# EAGLE design emonPi2C_V1.1 (EAGLE 7.3.0)
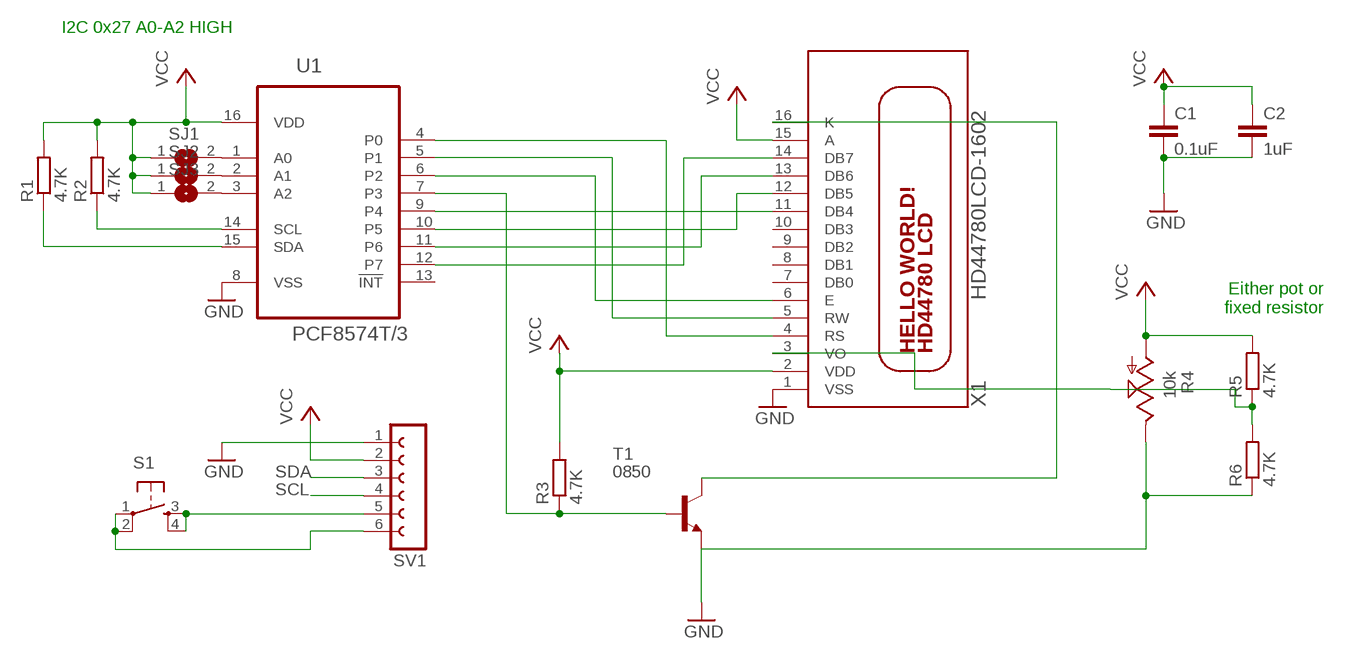
[diagram p0: schematic, sheet 1]

## Parts
C1  0.1uF  C-EUC0603  [C0603]
C2  1uF  C-EUC0603  [C0603]
R1  4.7K  R-EU_R0603  [R0603]
R2  4.7K  R-EU_R0603  [R0603]
R3  4.7K  R-EU_R0603  [R0603]
R4  10k  TRIM_US-B25P  [B25P]
R5  4.7K  R-EU_R0603  [R0603]
R6  4.7K  R-EU_R0603  [R0603]
S1  TAC_SWITCHPTH  [TACTILE-PTH]
SJ1  SJ  [SJ]
SJ2  SJ  [SJ]
SJ3  SJ  [SJ]
SV1  FE06-1  [FE06]
T1  0850  BCX70SMD  [SOT23]
U1  PCF8574T/3  [SOIC127P1032X265-16N]
X1  HD44780LCD-1602  [LCD1602]

## Nets
5V [Power]: C1.1 C2.1 R1.2 R2.2 R3.2 R4.A R5.2 SJ1.1 SJ2.1 SJ3.1 SV1.2 U1.16(VDD) X1.2(VDD) X1.15(A) ; supply symbol labelled VCC
CS: U1.6(P2) X1.6(E)
DB4: U1.9(P4) X1.11(DB4)
DB5: U1.10(P5) X1.12(DB5)
DB6: U1.11(P6) X1.13(DB6)
DB7: U1.12(P7) X1.14(DB7)
GND: C1.2 C2.2 R4.E R6.1 SV1.1 T1.2(E) U1.8(VSS) X1.1(VSS)
K: T1.3(C) X1.16(K)
N$3: SJ3.2 U1.3(A2)
N$4: SJ2.2 U1.2(A1)
N$5: S1.3 S1.4 SV1.5
N$6: S1.1 S1.2 SV1.6
N$7: SJ1.2 U1.1(A0)
N$10: R4.S R5.1 R6.2 X1.3(VO)
P3: R3.1 T1.1(B) U1.7(P3)
RS: U1.4(P0) X1.4(RS)
RW: U1.5(P1) X1.5(RW)
SCL: R2.1 SV1.4 U1.14(SCL)
SDA: R1.1 SV1.3 U1.15(SDA)
Unconnected: U1.13(!INT) X1.7(DB0) X1.8(DB1) X1.9(DB2) X1.10(DB3)

## Notes on the sheet
- I2C 0x27 A0-A2 HIGH
- Either pot or
  fixed resistor

## Library data of the parts
C1 C2 = resistor:C-EU: CAPACITOR, European symbol
R1-R3 R5 R6 = rcl:R-EU_: RESISTOR, European symbol
R4 = pot:TRIM_US-: POTENTIOMETER
S1 = SparkFun-Electromechanical:TAC_SWITCH: Momentary Switch Button commonly used for reset or general input. Spark Fun Electronics SKU : COM-00097 SMT- SWCH-08247
SJ1-SJ3 = jumper:SJ: SMD solder JUMPER
SV1 = con-lsta:FE06-1: FEMALE HEADER; OC_FARNELL: unknown; OC_NEWARK: unknown
T1 = transistor:BCX70SMD: NPN TRANSISTOR
U1 = PCF8574T:PCF8574T/3: I/O EXPANDER, 8BIT REMOTE, SO-16; MPN: PCF8574T/3; OC_FARNELL: 1506644; OC_NEWARK: Unknown; PACKAGE: SO-16; SUPPLIER: NXP
X1 = adafruit:HD44780LCD: HD44780 LCD Standard character type LCDs, available in sizes from 8x1 to 40x4!

## Net classes
0 default: width 0.254 mm, drill 0.5 mm, clearance 0.254 mm
1 Power: width 0.61 mm, drill 0.5 mm, clearance 0.406 mm

## Board
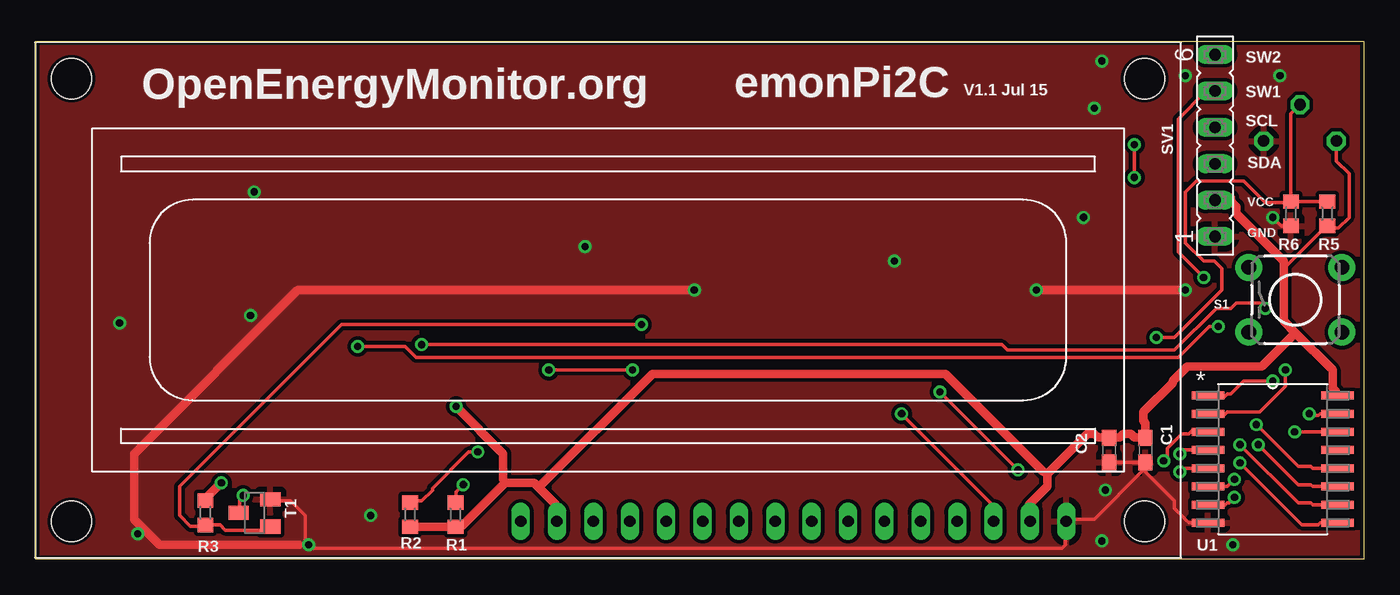
[diagram p1: board, top side]
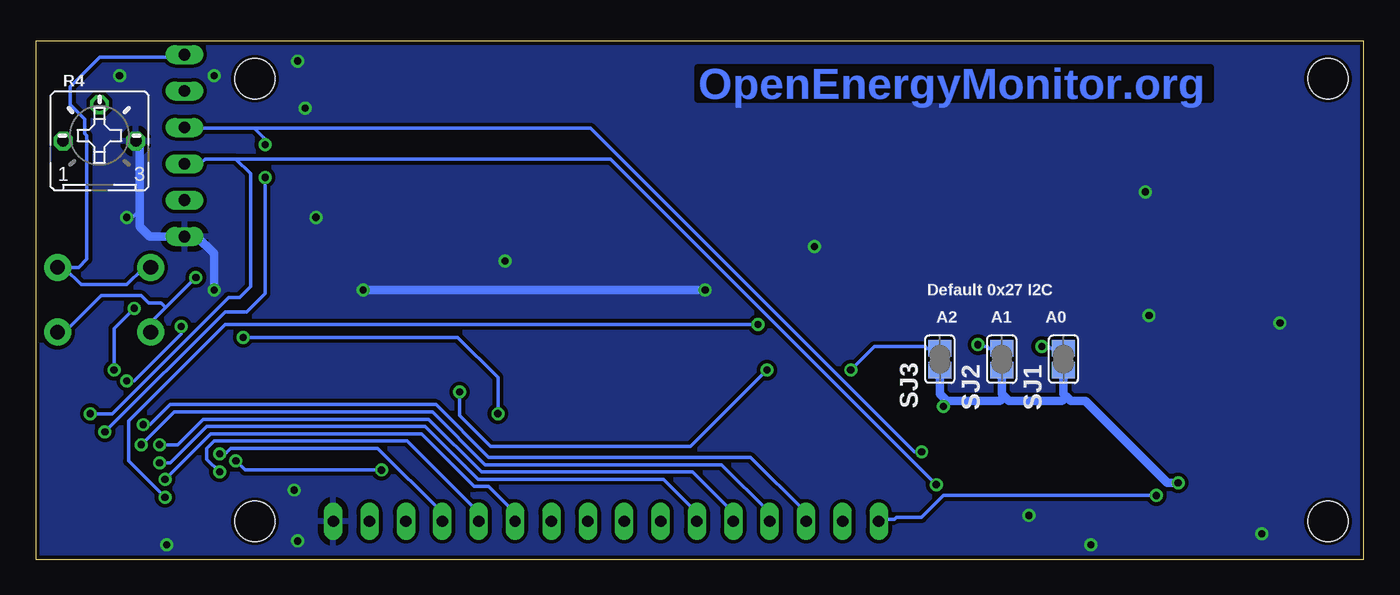
[diagram p2: board, bottom side, seen from below]

Size 92.71 x 36.2 mm. Coordinates in mm from the lower left corner, seen from the top.
Outline: 0,36.2 92.71,36.2 92.71,0 0,0 0,36.2
Copper layers (1*16): Top 0.035mm / dielectric 1.5mm / Bottom 0.035mm
Design rules "default *": minimum track width 8mil, minimum drill 0.5mm, track to track 8mil, track to pad 8mil, pad to pad 8mil, via to via 8mil, smd to smd 8mil, copper to edge 10mil, drill to drill 10mil, minimum pad ring 10mil, minimum via ring 8mil, stop-mask expansion 4mil, vias tented up to drill 0.5mm, thermal gap 16mil

### Footprints (pad centres in the part's own frame; a part is rotated, then mirrored left to right if it is on the bottom)
C0603 = smd 1.1 x 1: 1 -0.85,0; 2 0.85,0
R0603 = smd 1 x 1.1: 1 -0.85,0; 2 0.85,0
B25P = drill 0.813 octagon: A -2.54,0; E 2.54,0; S 0,2.54
TACTILE-PTH = drill 1.016 pad 1.88: 1 -3.251,2.261; 2 3.251,2.261; 3 -3.251,-2.261; 4 3.251,-2.261
SJ = smd 1.168 x 1.6: 1 -0.762,0; 2 0.762,0
FE06 = drill 0.813 long: 1 -6.35,0; 2 -3.81,0; 3 -1.27,0; 4 1.27,0; 5 3.81,0; 6 6.35,0
SOT23 = smd 1 x 1.4: 1 -0.95,-1.1; 2 0.95,-1.1; 3 0,1.1
SOIC127P1032X265-16N = smd 2.286 x 0.559: 1 -4.521,4.445; 2 -4.521,3.175; 3 -4.521,1.905; 4 -4.521,0.635; 5 -4.521,-0.635; 6 -4.521,-1.905; 7 -4.521,-3.175; 8 -4.521,-4.445; 9 4.521,-4.445; 10 4.521,-3.175; 11 4.521,-1.905; 12 4.521,-0.635; 13 4.521,0.635; 14 4.521,1.905; 15 4.521,3.175; 16 4.521,4.445
LCD1602 = drill 0.8 long: 1 8,33.46; 2 10.54,33.46; 3 13.08,33.46; 4 15.62,33.46; 5 18.16,33.46; 6 20.7,33.46; 7 23.24,33.46; 8 25.78,33.46; 9 28.32,33.46; 10 30.86,33.46; 11 33.4,33.46; 12 35.94,33.46; 13 38.48,33.46; 14 41.02,33.46; 15 43.56,33.46; 16 46.1,33.46 | hole 2.8: 2.54,2.54; 2.54,33.46; 77.46,33.46; 77.46,2.54

### Placement (x,y rotation side)
C1  77.47,7.62 270 top
C2  74.93,7.62 270 top
R1  29.3,3.12 270 top
R2  26.12,3.12 270 top
R3  11.85,3.23 90 top
R4  88.27,29.21 0 bottom
R5  90.17,24.13 270 top
R6  87.63,24.13 90 top
S1  87.94,18.12 0 top
SJ1  20.95,13.97 90 bottom
SJ2  25.27,13.97 90 bottom
SJ3  29.59,13.97 90 bottom
SV1  82.33,28.89 90 top
T1  15.28,3.23 90 top
U1  86.36,6.99 0 top
X1  79.95,36.1 180 top

### Tracks (layer width: path | path; a pad name or v marks a point on that pad's centre or on a via)
5V  (via drill 0.5)
  Top 0.254: 87.12,20.32 90.08,23.28 R5.2 90.34,23.11 90.93,23.11 91.69,23.88 91.69,26.92 90.81,27.81 R4.A
  Top 0.61: 25.91,2.29 R2.2 R1.2 29.59,2.29 29.72,2.29 32.77,5.33 | 35.12,5.02 34.8,5.33 32.77,5.33 | 35.12,5.02 36.32,3.81 36.32,2.67 X1.15 | v12.95,5.33 11.94,4.32 11.94,4.19 R3.2 | v29.34,10.67 32.64,7.37 32.64,5.59 32.77,5.33 | 70.61,5.97 73.41,8.76 73.91,8.76 74.17,8.51 74.68,8.51 C2.1 74.93,8.51 75.69,8.51 75.95,8.76 76.45,8.76 76.71,8.51 77.47,8.51 C1.1 77.47,9.53 77.34,9.65 77.34,10.29 79.38,12.32 79.38,12.45 80.39,13.46 85.6,13.46 87.95,15.81 | 70.61,5.97 70.61,5.08 69.34,3.81 69.34,2.67 X1.2 | 87.95,15.81 87.12,16.64 87.12,20.32 87.12,20.83 83.82,24.13 83.82,24.64 83.31,25.15 | 87.95,15.81 90.55,13.21 90.55,11.94 90.81,11.68 90.81,11.43 U1.16 | 83.31,25.15 83.44,25.27 | 83.31,25.15 82.42,25.15 SV1.2 | 90.55,29.21 R4.A | 35.12,5.02 43.05,12.95 63.5,12.95 70.36,6.1 70.61,5.97
  Bottom 0.61: v12.95,5.33 13.72,5.33 19.43,11.05 20.45,11.05 20.77,11.37 | 20.77,11.37 20.95,11.56 SJ1.1 | SJ2.1 25.27,11.56 25.08,11.37 | 25.08,11.37 24.77,11.05 21.08,11.05 20.77,11.37 | SJ3.1 29.59,11.56 29.08,11.05 | 29.08,11.05 25.4,11.05 25.08,11.37 | v29.34,10.67 29.21,10.79 29.08,11.05
CS  (via drill 0.5)
  Top 0.254: U1.6 83.19,5.08 v83.69,5.59
  Bottom 0.254: v83.69,5.59 80.52,8.76 65.79,8.76 62.1,5.08 61.09,5.08 59.31,3.3 59.31,2.67 X1.6
DB4  (via drill 0.5)
  Top 0.254: U1.9 89.66,2.54 89.53,2.41 88.39,2.41 v84.07,6.73
  Bottom 0.254: v84.07,6.73 83.31,6.73 80.77,9.27 65.53,9.27 61.85,5.59 48.9,5.59 46.61,3.3 46.61,2.67 X1.11
DB5  (via drill 0.5)
  Top 0.254: U1.10 89.15,3.81 89.03,3.94 88.14,3.94 v84.07,8
  Bottom 0.254: v84.07,8 82.8,8 81.03,9.78 65.28,9.78 61.59,6.1 46.86,6.1 44.07,3.3 44.07,2.67 X1.12
DB6  (via drill 0.5)
  Top 0.254: U1.11 89.15,5.08 89.03,5.21 88.14,5.21 v85.34,8
  Bottom 0.254: v85.34,8 83.06,10.29 65.02,10.29 61.34,6.6 44.83,6.6 41.53,3.3 41.53,2.67 X1.13
DB7  (via drill 0.5)
  Top 0.254: U1.12 89.15,6.35 89.03,6.48 88.14,6.48 v85.22,9.4
  Bottom 0.254: v85.22,9.4 84.71,9.4 83.31,10.79 64.77,10.79 61.09,7.11 42.8,7.11 38.99,3.3 38.99,2.67 X1.14
GND  (via drill 0.5)
  Top 0.254: 77.34,6.22 77.47,6.35 C1.2 C2.2 | 77.34,6.22 73.91,2.79 72.1,2.79 X1.1 71.88,2.58 71.88,1.02 71.63,0.76 19.3,0.76 v19.05,1.02 | U1.8 80.52,2.54 79.5,3.56 79.5,4.06 77.34,6.22 | T1.2 16.5,4.06 17.78,4.06 18.8,3.05 18.8,1.27 v19.05,1.02 | v19.05,1.02 17.78,1.02 | R6.1 86.96,23.28 v86.36,23.88
  Top 0.61: v80.26,18.8 v69.85,18.8 | v45.97,18.8 18.29,18.8 6.86,7.37 6.86,2.79 8.64,1.02 17.78,1.02 18.38,1.02
  Bottom 0.254: v86.36,23.88 85.98,23.88 85.47,24.38
  Bottom 0.61: v69.85,18.8 v45.97,18.8 | R4.E 85.47,28.96 85.47,24.38 85.47,23.24 84.77,22.54 SV1.1 81.47,22.54 80.26,21.34 v80.26,18.8
  other vias: 59.94,20.83 74.68,4.83 74.42,1.27 83.57,1.02 38.35,21.84 14.99,17.02 15.24,25.65 5.84,16.51 7.11,1.78 23.37,3.05 73.91,31.5 74.42,34.8 80.26,33.78 86.87,33.78 73.15,23.88
  pour Bottom: 0,36.07 92.71,36.07 92.71,0 0,0
  pour Top: 0,36.07 92.71,36.07 92.71,0 0,0
K  (via drill 0.5)
  Top 0.254: v14.48,4.45 14.22,4.19 14.22,3.3 T1.3
  Bottom 0.254: v14.48,4.45 29.34,4.45 30.86,2.92 32.64,2.92 32.77,2.79 33.66,2.79 33.78,2.67 X1.16
N$3  (via drill 0.5)
  Top 0.254: v41.66,13.21 v35.81,13.21 | v68.58,6.22 v63.12,11.68 | v78.74,6.86 78.99,7.11 78.99,7.75 80.01,8.76 80.52,8.76 80.77,9.02 81.66,9.02 81.79,8.89 U1.3
  Bottom 0.254: SJ3.2 30.48,14.73 30.61,14.86 34.16,14.86 v35.81,13.21 | v68.58,6.22 78.11,6.22 v78.74,6.86 | v63.12,11.68 63.12,10.03 60.96,7.87 46.99,7.87 v41.66,13.21
N$4  (via drill 0.5)
  Top 0.254: v26.92,14.99 67.44,14.99 67.82,14.61 79.5,14.61 82.42,17.53 83.44,17.53 83.82,17.91 85.47,17.91 v85.85,17.53 | v87.25,13.21 87.25,12.06 85.47,10.29 83.19,10.29 82.93,10.03 82.04,10.03 81.92,10.16 U1.2
  Bottom 0.254: SJ2.2 26.16,14.73 26.29,14.86 26.8,14.86 v26.92,14.99 | v85.85,17.53 87.25,16.13 v87.25,13.21
N$5  (via drill 0.5)
  Top 0.254: v81.53,19.68 79.76,21.46 79.76,30.73 81.66,32.64 82.3,32.64 SV1.5
  Bottom 0.254: 83.63,17.59 84.58,16.64 84.58,15.88 S1.3 | 83.63,17.59 v81.53,19.68 | 83.63,17.59 83.95,17.91 84.84,17.91 85.34,18.41 88.14,18.41 90.68,15.88 91.19,15.88 S1.4
N$6
  Bottom 0.254: S1.1 84.71,20.32 85.22,20.32 86.36,19.18 89.53,19.18 90.68,20.32 91.19,20.32 S1.2 89.73,20.38 89.15,20.95 89.15,29.59 89.28,29.72 89.28,30.73 90.3,31.75 90.3,33.02 88.27,35.05 82.52,35.05 SV1.6
N$7  (via drill 0.5)
  Top 0.254: v22.48,14.86 25.78,14.86 26.54,14.1 79.76,14.1 81.92,16.26 v82.55,16.26 | v86.36,12.45 84.33,12.45 83.44,11.56 83.19,11.56 82.93,11.3 82.04,11.3 81.92,11.43 U1.1
  Bottom 0.254: SJ1.2 21.84,14.73 21.97,14.86 v22.48,14.86 | v82.55,16.26 82.55,15.75 85.85,12.45 v86.36,12.45
N$10  (via drill 0.5)
  Top 0.254: R6.2 87.63,31.11 R4.S | R6.2 R5.1 | R6.2 87.46,24.98 87.38,24.89 85.85,24.89 84.33,26.42 81.03,26.42 80.26,25.65 80.26,22.1 81.53,20.83 82.3,20.83 82.8,20.32 82.8,18.8 79.5,15.49 v78.23,15.49 | X1.3 66.87,3.74 v60.45,10.16
  Bottom 0.254: v60.45,10.16 60.45,12.7 63.25,15.49 v78.23,15.49
P3  (via drill 0.5)
  Top 0.254: U1.7 83.06,3.81 83.19,3.94 83.31,3.94 v83.69,4.32 | v42.29,16.38 21.34,16.38 10.03,5.08 10.03,3.05 10.79,2.29 11.81,2.29 R3.1 12.86,2.38 13.21,2.03 16.12,2.03 T1.1
  Bottom 0.254: v83.69,4.32 86.23,6.86 86.23,9.65 79.5,16.38 v42.29,16.38
RS  (via drill 0.5)
  Top 0.254: U1.4 80.14,7.62 v79.88,7.37
  Bottom 0.254: v79.88,7.37 79.5,7.37 79.12,7.75 68.83,7.75 64.39,3.3 64.39,2.67 X1.4
RW  (via drill 0.5)
  Top 0.254: U1.5 80.14,6.35 v79.88,6.1
  Bottom 0.254: v79.88,6.1 80.77,6.99 80.77,7.75 80.26,8.26 66.8,8.26 61.85,3.3 61.85,2.67 X1.5
SCL  (via drill 0.5)
  Top 0.254: v30.86,7.49 30.23,7.49 27.69,4.95 27.69,4.83 26.92,4.06 26.16,4.06 R2.1 | U1.14 v87.88,8.89 | v76.71,26.67 v76.71,28.96
  Bottom 0.254: v30.86,7.49 31.37,7.49 53.98,30.1 77.47,30.1 | SV1.4 82.3,30.1 77.47,30.1 | v87.88,8.89 79.5,17.27 77.98,17.27 76.71,18.54 v76.71,26.67 | v76.71,28.96 76.71,29.34 77.47,30.1
SDA  (via drill 0.5)
  Top 0.254: v29.84,5.21 29.34,4.7 29.34,4.06 R1.1 | U1.15 89.66,10.16 89.53,10.03 89.03,10.03 v88.9,10.16
  Bottom 0.254: v29.84,5.21 52.58,27.94 78.74,27.94 | SV1.3 82.3,27.69 81.15,27.69 80.9,27.94 78.74,27.94 | v88.9,10.16 87.38,10.16 79.25,18.29 78.49,18.29 77.72,19.05 77.72,26.92 78.74,27.94

### Text on the board
Bottom: OpenEnergyMonitor.org
tNames: SW2 | OpenEnergyMonitor.org | emonPi2C | V1.1 Jul 15 | SW1 | SCL | SDA | VCC | GND
bNames: Default 0x27 I2C | A0 | A1 | A2